# EAGLE design test (EAGLE 9.5.1)

## Sheet 1 of 5: Connectors
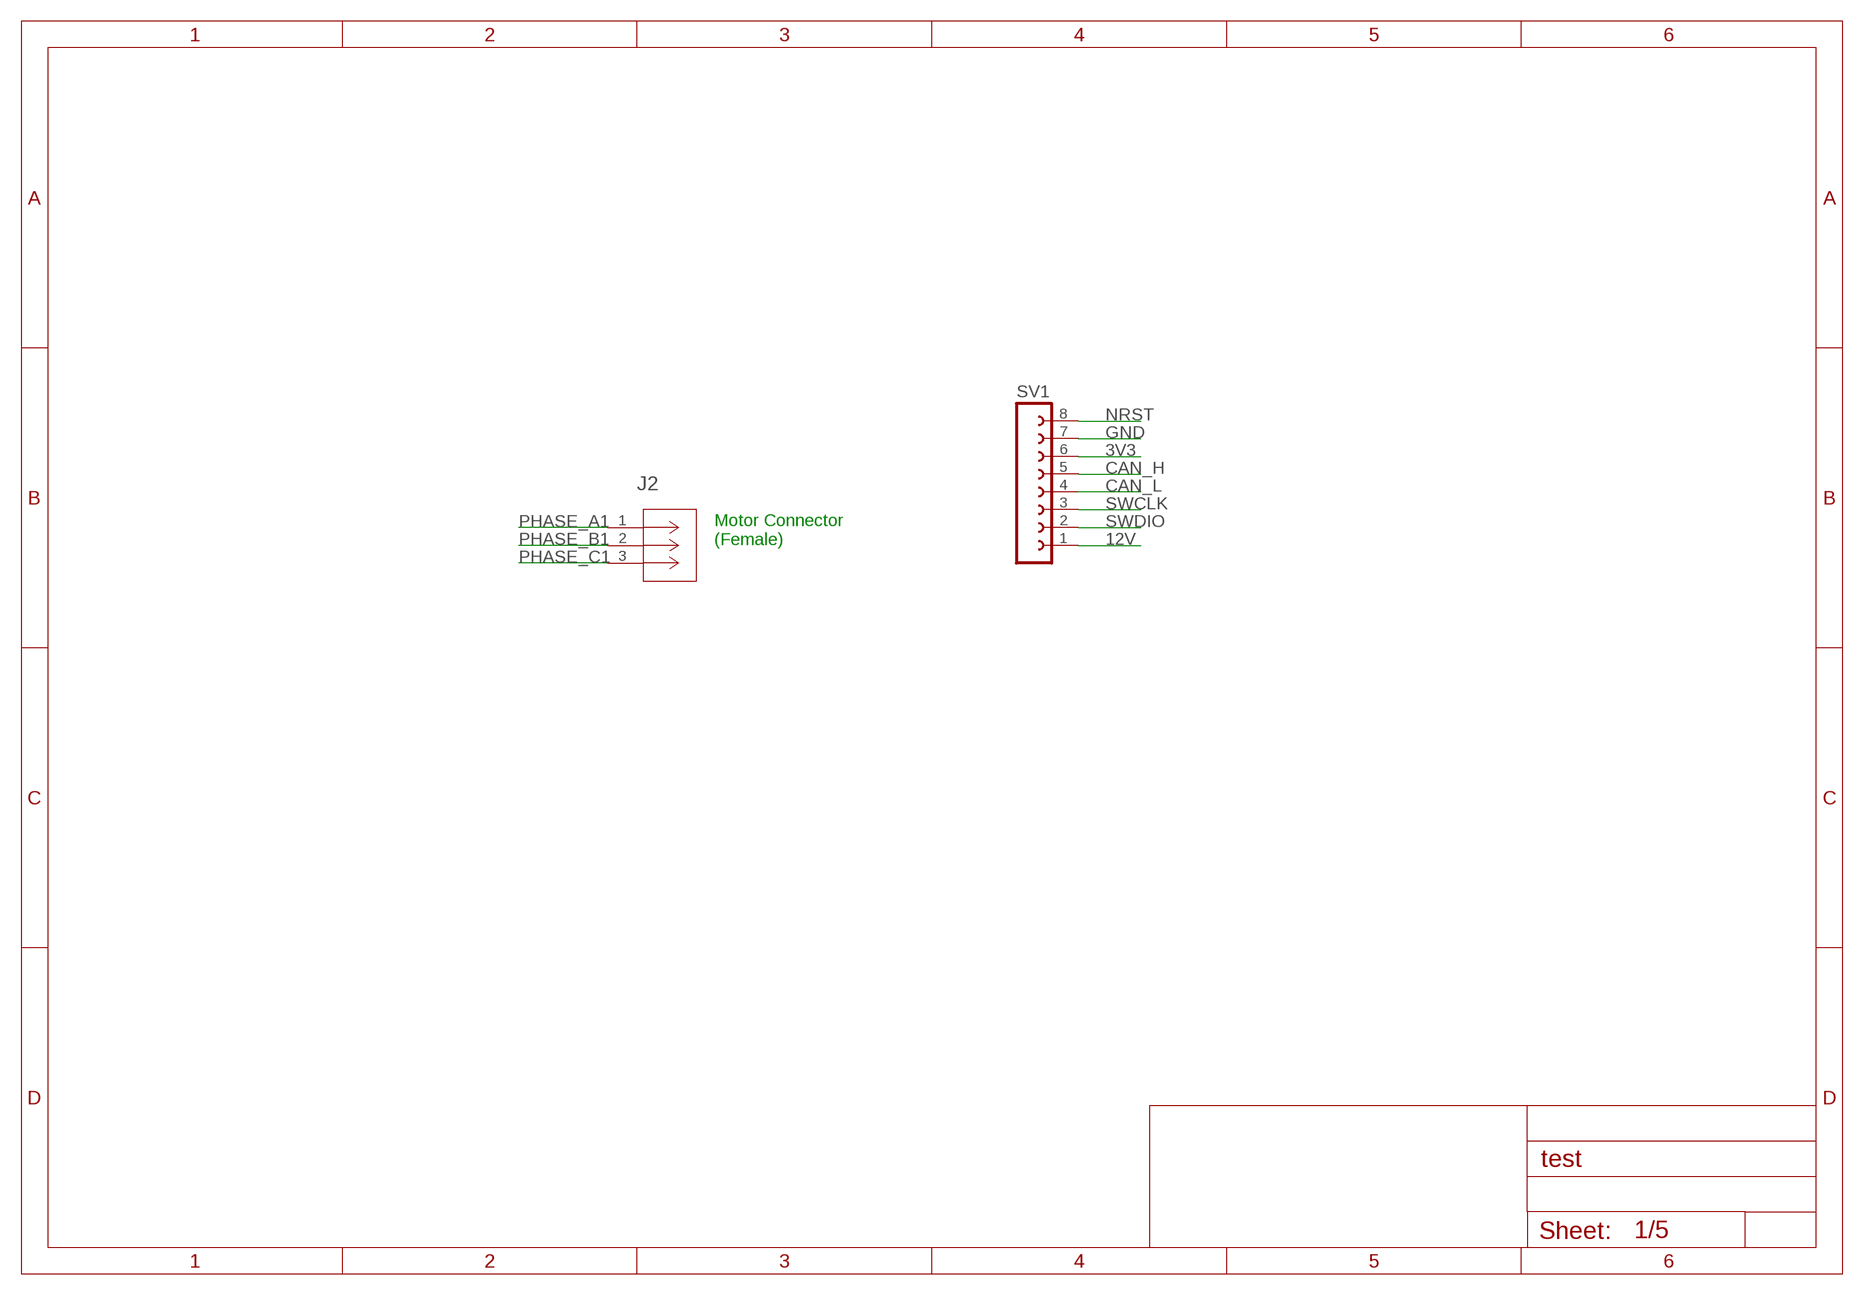
[diagram p0: schematic, sheet 1]

### Parts
J2  1755529  [CONN_1755529]
SV1  FE08-1  [FE08]

### Nets
3V3: SV1.6 ; also sheet 2,3
12V: SV1.1 ; also sheet 4,5
CAN_H: SV1.5 ; also sheet 2
CAN_L: SV1.4 ; also sheet 2
GND: SV1.7 ; also sheet 2,3,4,5
NRST: SV1.8 ; also sheet 3
PHASE_A1: J2.1 ; also sheet 5
PHASE_B1: J2.2 ; also sheet 5
PHASE_C1: J2.3 ; also sheet 5
SWCLK: SV1.3 ; also sheet 3
SWDIO: SV1.2 ; also sheet 3

### Notes on the sheet
- Motor Connector
  (Female)

## Sheet 2 of 5: CAN
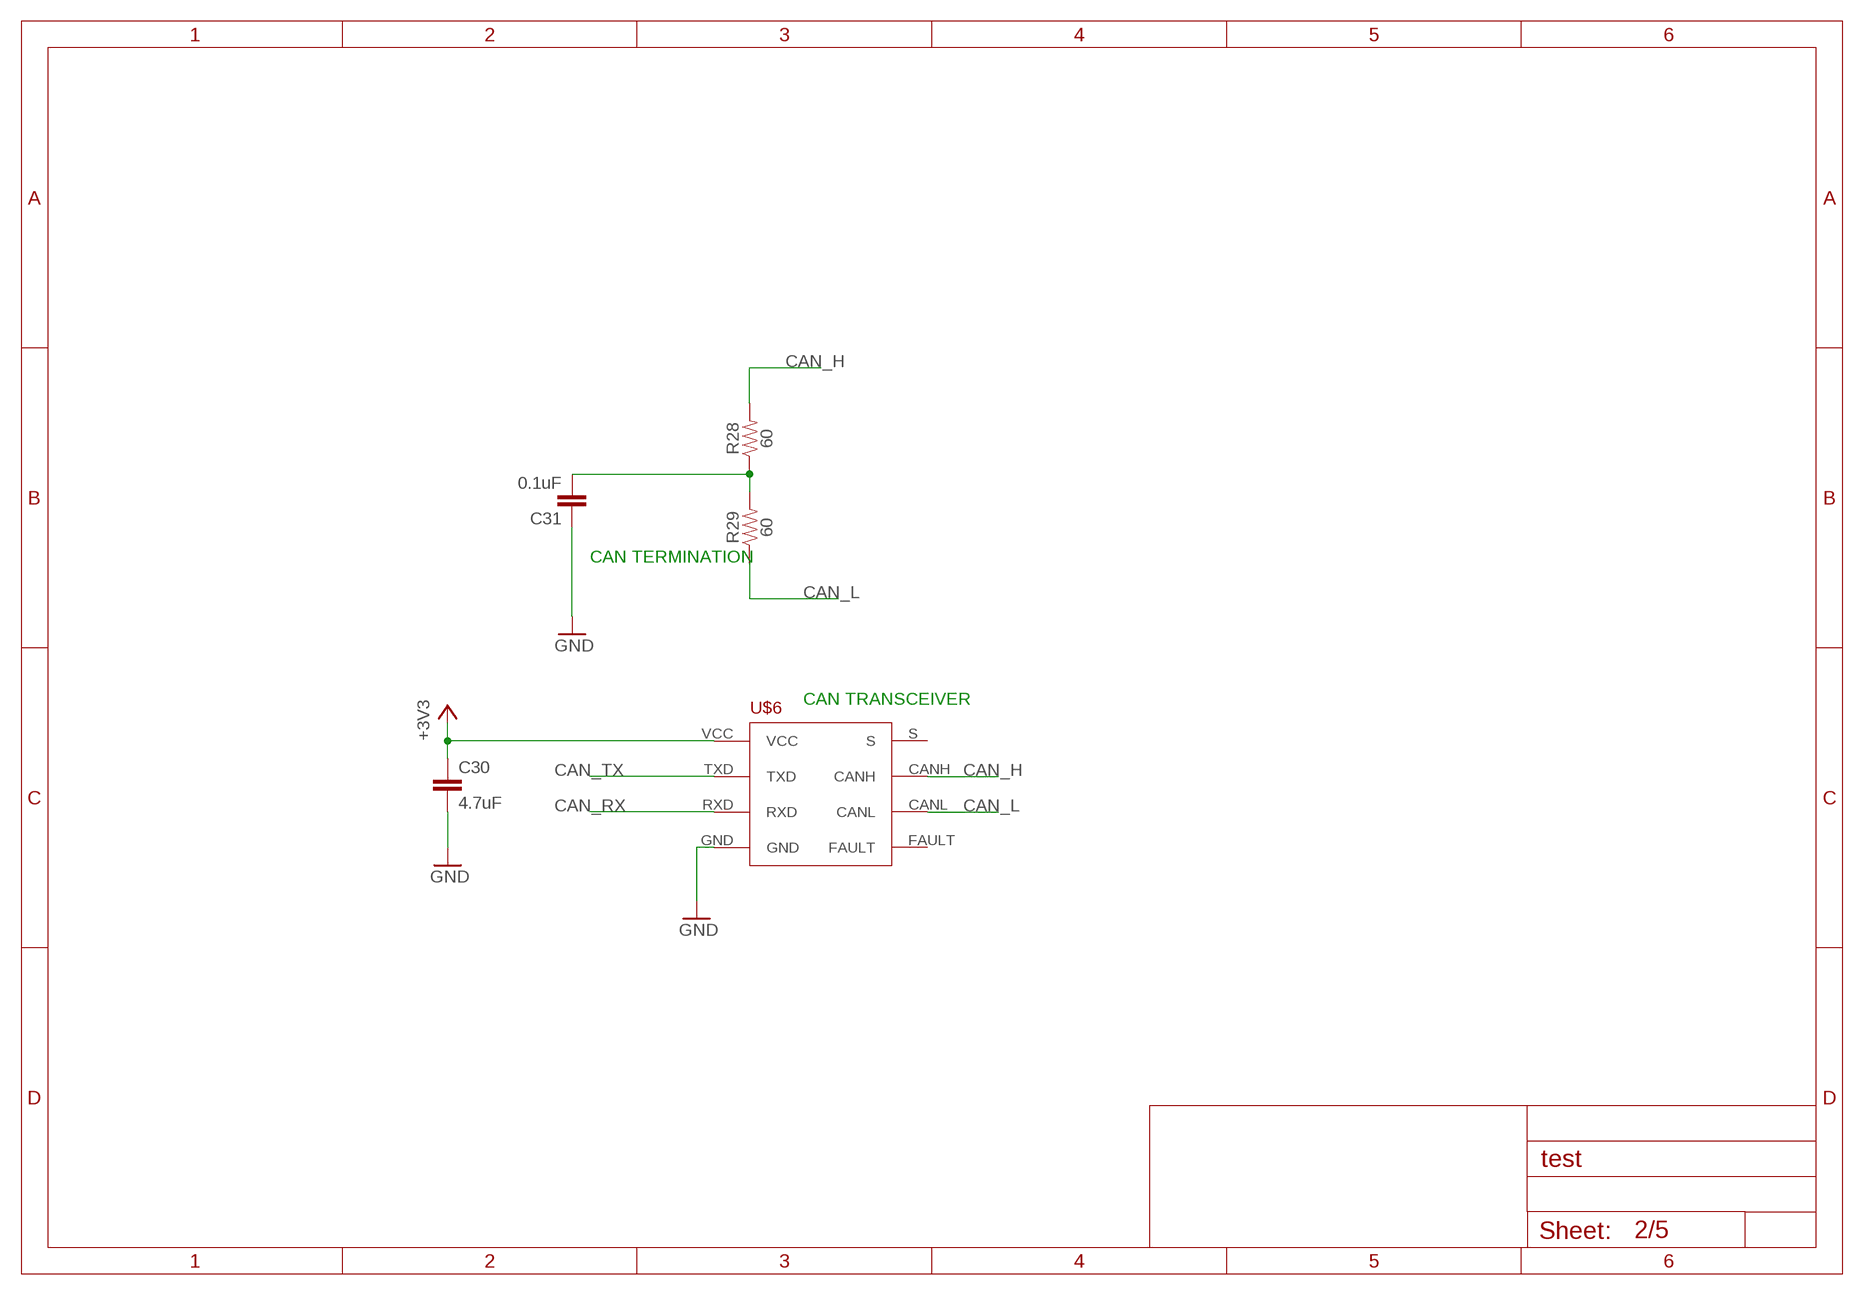
[diagram p1: schematic, sheet 2]

### Parts
C30  4.7uF  4.7UF0603  [0603]
C31  0.1uF  0.1UF-0603-25V-(+80/-20%)  [0603]
R28  60  1KOHM-0603-1/10W-1%  [0603]
R29  60  1KOHM-0603-1/10W-1%  [0603]
U$6  TCAN337D  [TCAN337D]

### Nets
3V3: C30.1 U$6.VCC ; supply symbol labelled +3V3 ; also sheet 1,3
CAN_H: R28.2 U$6.CANH ; also sheet 1
CAN_L: R29.1 U$6.CANL ; also sheet 1
CAN_RX: U$6.RXD ; also sheet 3
CAN_TX: U$6.TXD ; also sheet 3
GND: C30.2 C31.1 U$6.GND ; also sheet 1,3,4,5
N$46: C31.2 R28.1 R29.2
Unconnected: U$6.FAULT U$6.S

### Notes on the sheet
- CAN TERMINATION
- CAN TRANSCEIVER

## Sheet 3 of 5: MCU
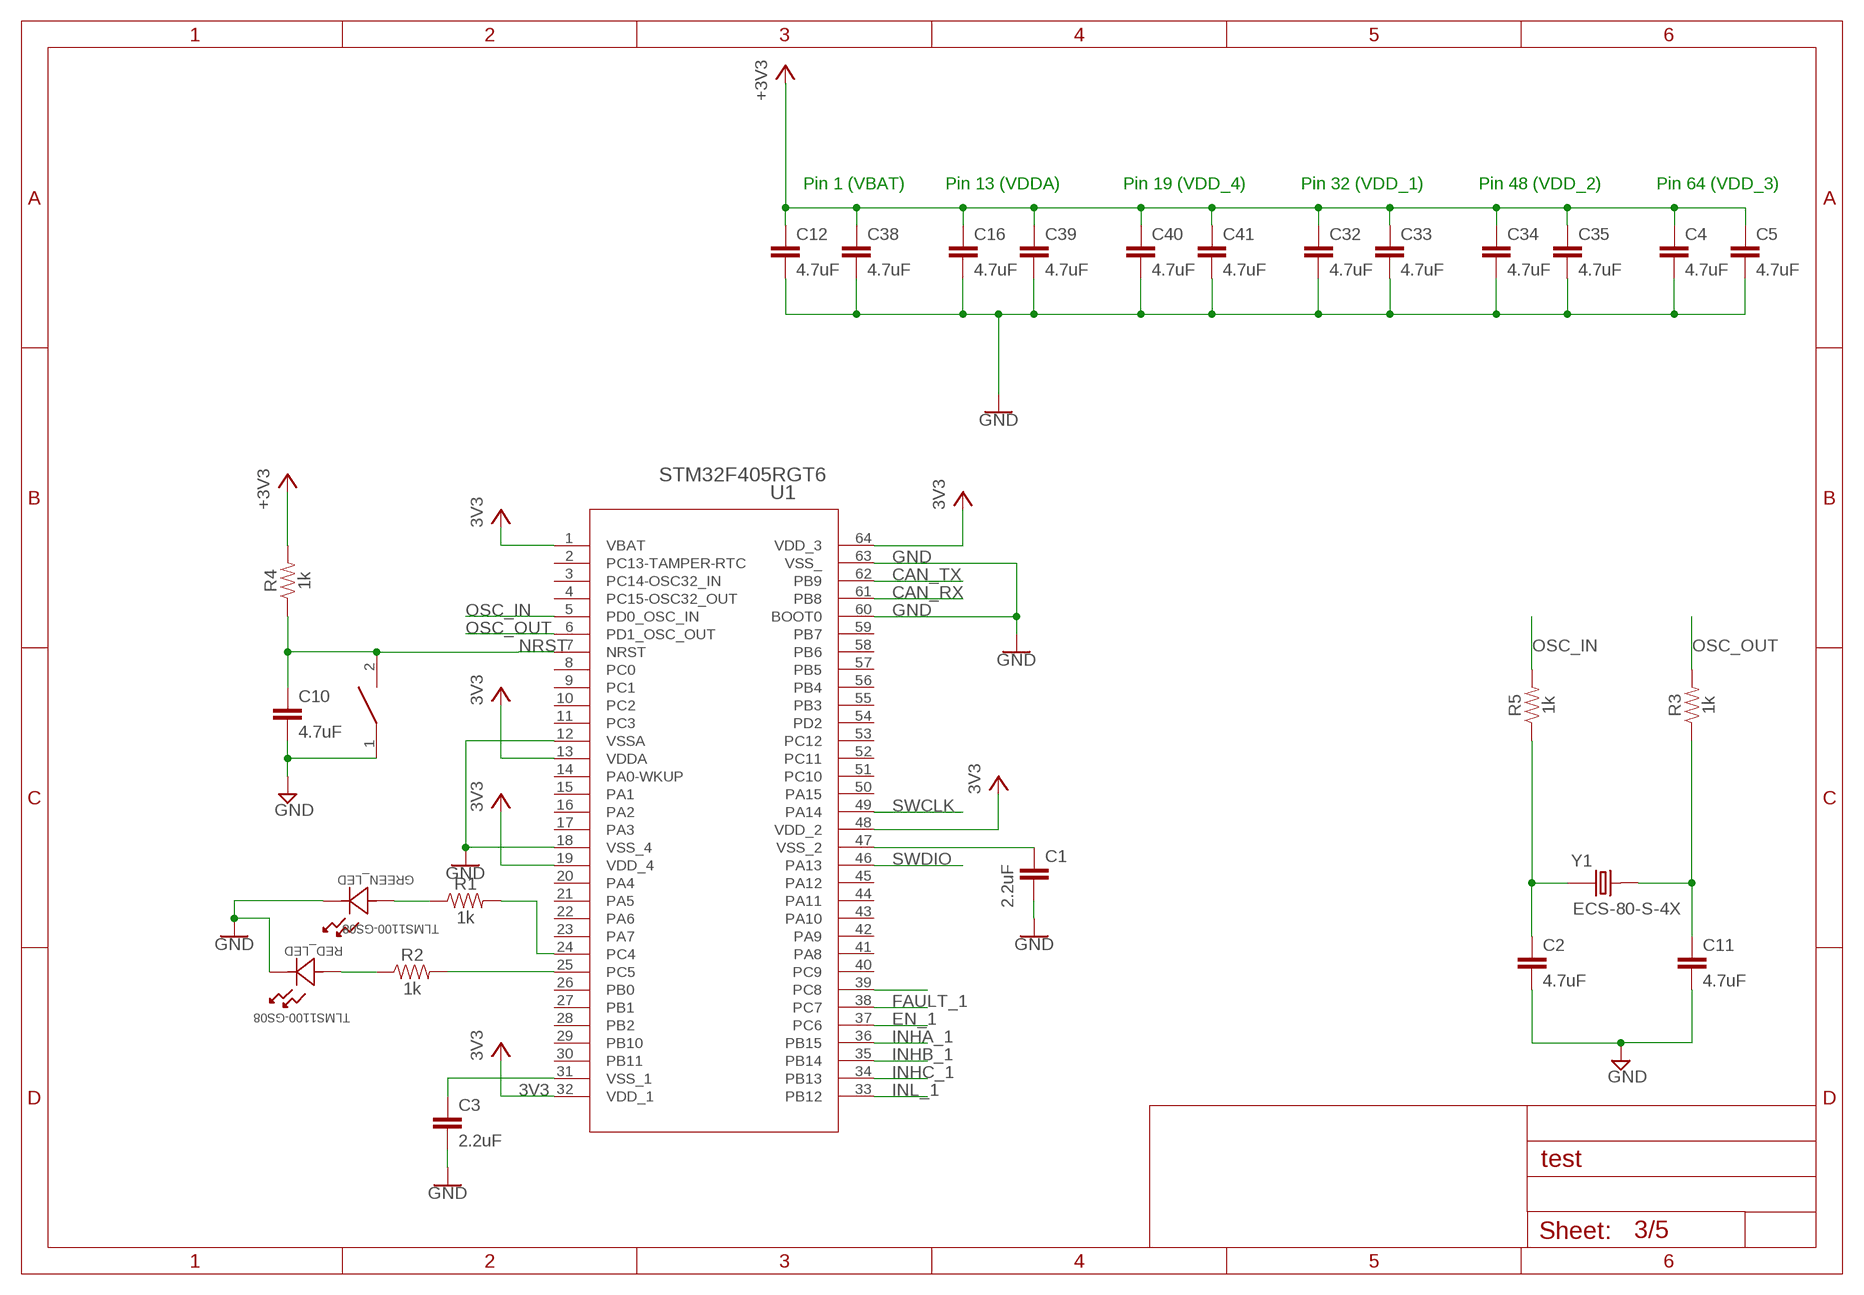
[diagram p2: schematic, sheet 3]

### Parts
C1  2.2uF  2.2UF-0603-10V-20%  [0603]
C2  4.7uF  4.7UF0603  [0603]
C3  2.2uF  2.2UF-0603-10V-20%  [0603]
C4  4.7uF  4.7UF0603  [0603]
C5  4.7uF  4.7UF0603  [0603]
C10  4.7uF  4.7UF0603  [0603]
C11  4.7uF  4.7UF0603  [0603]
C12  4.7uF  4.7UF0603  [0603]
C16  4.7uF  4.7UF0603  [0603]
C32  4.7uF  4.7UF0603  [0603]
C33  4.7uF  4.7UF0603  [0603]
C34  4.7uF  4.7UF0603  [0603]
C35  4.7uF  4.7UF0603  [0603]
C38  4.7uF  4.7UF0603  [0603]
C39  4.7uF  4.7UF0603  [0603]
C40  4.7uF  4.7UF0603  [0603]
C41  4.7uF  4.7UF0603  [0603]
GREEN_LED  TLMS1100-GS08  [LED_VISHAY_TLMX1100]
R1  1k  1KOHM-0603-1/10W-1%  [0603]
R2  1k  1KOHM-0603-1/10W-1%  [0603]
R3  1k  1KOHM-0603-1/10W-1%  [0603]
R4  1k  1KOHM-0603-1/10W-1%  [0603]
R5  1k  1KOHM-0603-1/10W-1%  [0603]
RED_LED  TLMS1100-GS08  [LED_VISHAY_TLMX1100]
RESET1  SWITCH  [SW_2512]
U1  STM32F405RGT6  [LQFP-64]
Y1  ECS-80-S-4X  [XTAL_ECS-80-S-4X]

### Nets
3V3: C4.1 C5.1 C12.1 C16.1 C32.1 C33.1 C34.1 C35.1 C38.1 C39.1 C40.1 C41.1 R4.2 U1.1(VBAT) U1.13(VDDA) U1.19(VDD_4) U1.32(VDD_1) U1.48(VDD_2) U1.64(VDD_3) ; supply symbol labelled +3V3 ; also sheet 1,2
CAN_RX: U1.61(PB8) ; also sheet 2
CAN_TX: U1.62(PB9) ; also sheet 2
EN_1: U1.37(PC6) ; also sheet 4
FAULT_1: U1.38(PC7) ; also sheet 4
GND: C1.2 C2.2 C3.2 C4.2 C5.2 C10.2 C11.2 C12.2 C16.2 C32.2 C33.2 C34.2 C35.2 C38.2 C39.2 C40.2 C41.2 GREEN_LED.1 RED_LED.1 RESET1.1 U1.12(VSSA) U1.18(VSS_4) U1.60(BOOT0) U1.63(VSS_) ; also sheet 1,2,4,5
INHA_1: U1.36(PB15) ; also sheet 4
INHB_1: U1.35(PB14) ; also sheet 4
INHC_1: U1.34(PB13) ; also sheet 4
INL_1: U1.33(PB12) ; also sheet 4
INL_2: U1.39(PC8)
N$1: R1.2 U1.24(PC4)
N$2: GREEN_LED.2 R1.1
N$3: R2.1 RED_LED.2
N$4: R2.2 U1.25(PC5)
N$5: C1.1 U1.47(VSS_2)
N$6: C3.1 U1.31(VSS_1)
N$7: C11.1 R3.1 Y1.2
N$8: C2.1 R5.1 Y1.1
NRST: C10.1 R4.1 RESET1.2 U1.7(NRST) ; also sheet 1
OSC_IN: R5.2 U1.5(PD0_OSC_IN)
OSC_OUT: R3.2 U1.6(PD1_OSC_OUT)
SWCLK: U1.49(PA14) ; also sheet 1
SWDIO: U1.46(PA13) ; also sheet 1
Unconnected: U1.2(PC13-TAMPER-RTC) U1.3(PC14-OSC32_IN) U1.4(PC15-OSC32_OUT) U1.8(PC0) U1.9(PC1) U1.10(PC2) U1.11(PC3) U1.14(PA0-WKUP) U1.15(PA1) U1.16(PA2) U1.17(PA3) U1.20(PA4) U1.21(PA5) U1.22(PA6) U1.23(PA7) U1.26(PB0) U1.27(PB1) U1.28(PB2) U1.29(PB10) U1.30(PB11) U1.40(PC9) U1.41(PA8) U1.42(PA9) U1.43(PA10) U1.44(PA11) U1.45(PA12) U1.50(PA15) U1.51(PC10) U1.52(PC11) U1.53(PC12) U1.54(PD2) U1.55(PB3) U1.56(PB4) U1.57(PB5) U1.58(PB6) U1.59(PB7)

### Notes on the sheet
- Pin 1 (VBAT) | Pin 13 (VDDA) | Pin 19 (VDD_4) | Pin 32 (VDD_1) | Pin 48 (VDD_2) | Pin 64 (VDD_3)

## Sheet 4 of 5: Gate Driver
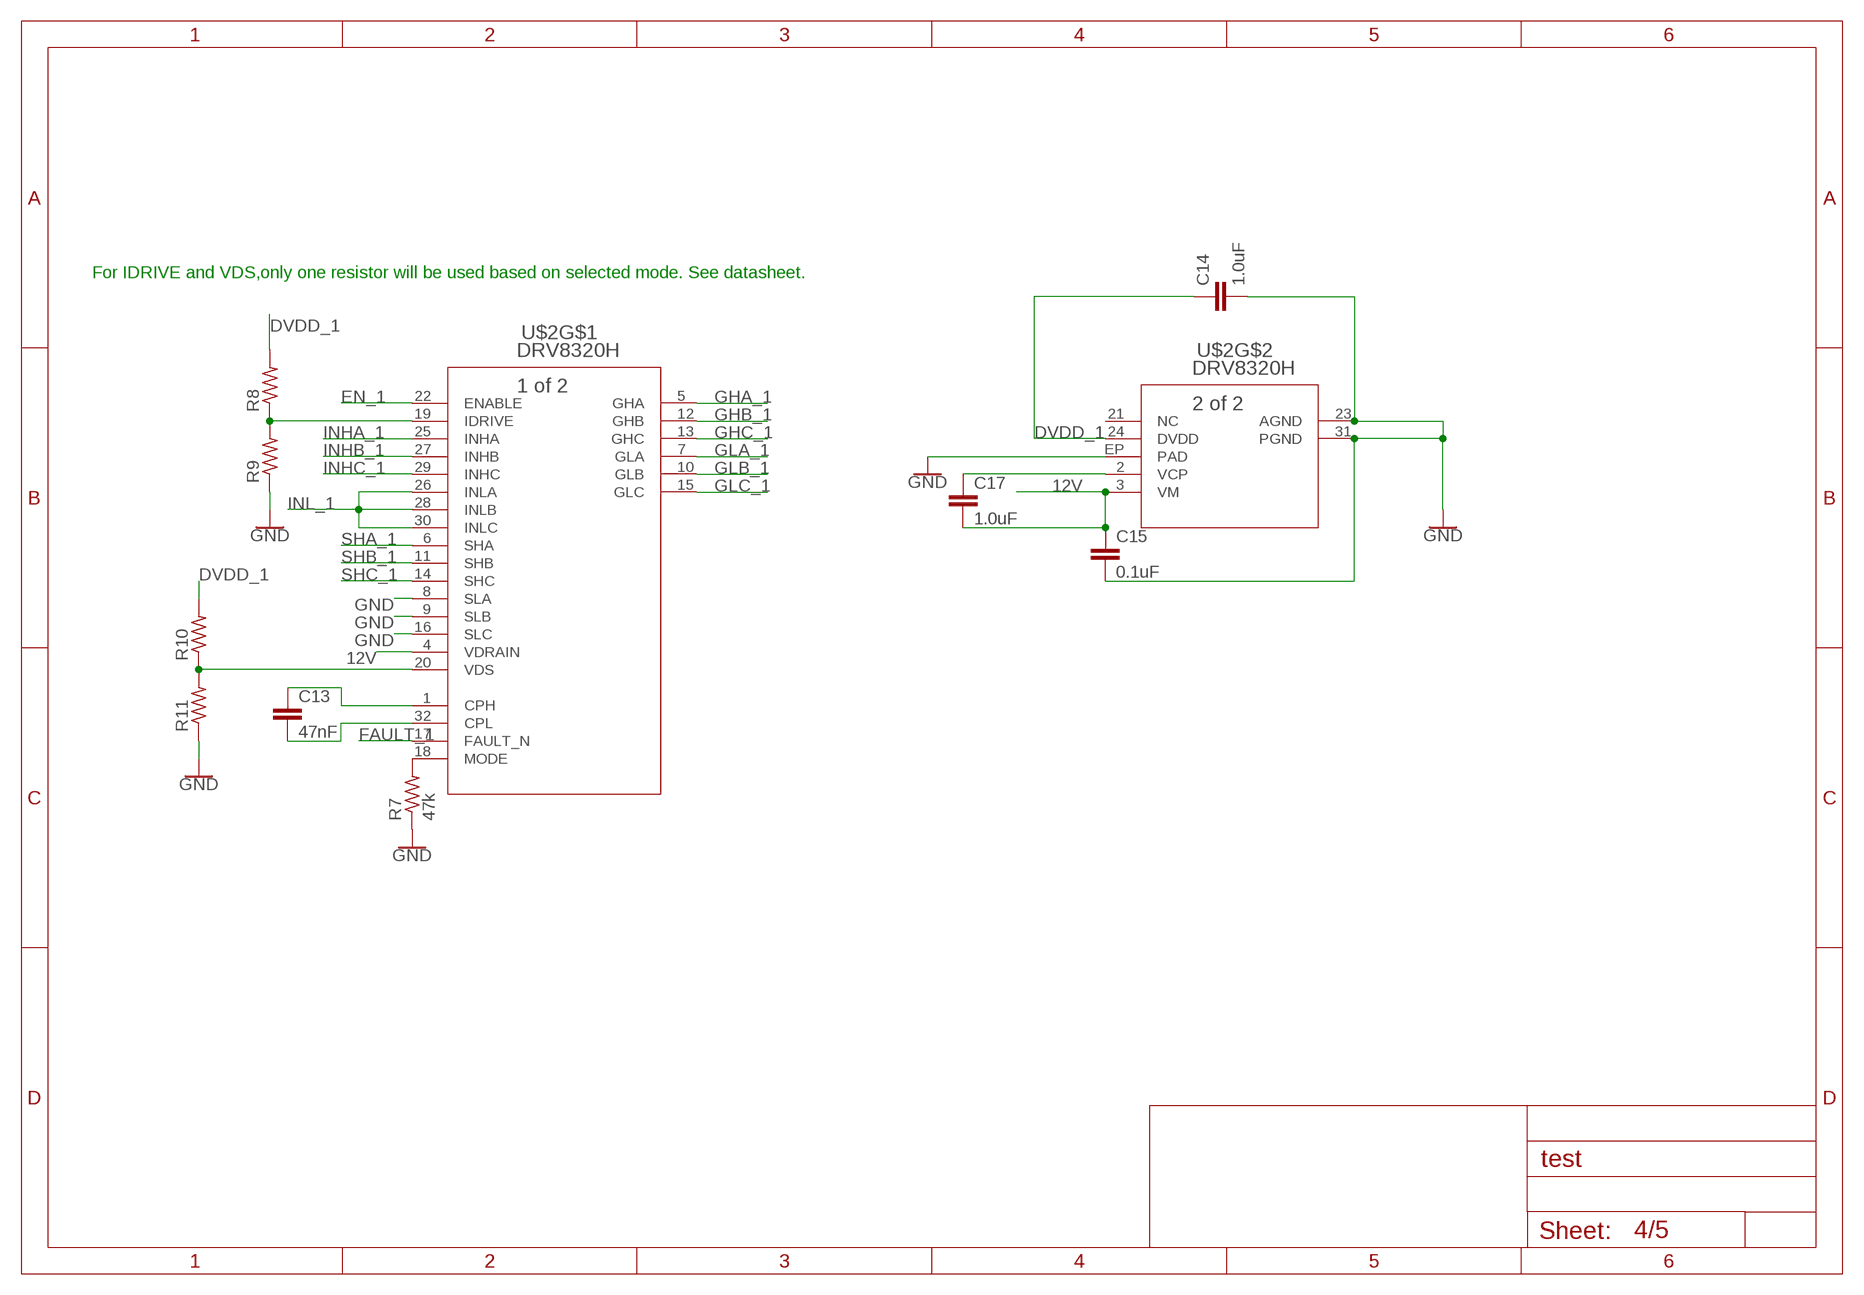
[diagram p3: schematic, sheet 4]

### Parts
C13  47nF  47NF-0603-25V-5%  [0603]
C14  1.0uF  1.0UF-0603-16V-10%  [0603]
C15  0.1uF  0.1UF-0603-25V-(+80/-20%)  [0603]
C17  1.0uF  1.0UF-0603-16V-10%  [0603]
R7  47k  R-US_R0603  [R0603]
R8  R-US_R0603  [R0603]
R9  R-US_R0603  [R0603]
R10  R-US_R0603  [R0603]
R11  R-US_R0603  [R0603]
U$2  DRV8320H  [QFN-32-5X5MM]

### Nets
12V: C15.1 C17.2 U$2.3(VM) U$2.4(VDRAIN) ; also sheet 1,5
DVDD_1: C14.1 R8.2 R10.2 U$2.24(DVDD)
EN_1: U$2.22(ENABLE) ; also sheet 3
FAULT_1: U$2.17(FAULT_N) ; also sheet 3
GHA_1: U$2.5(GHA) ; also sheet 5
GHB_1: U$2.12(GHB) ; also sheet 5
GHC_1: U$2.13(GHC) ; also sheet 5
GLA_1: U$2.7(GLA) ; also sheet 5
GLB_1: U$2.10(GLB) ; also sheet 5
GLC_1: U$2.15(GLC) ; also sheet 5
GND: C14.2 C15.2 R7.1 R9.1 R11.1 U$2.8(SLA) U$2.9(SLB) U$2.16(SLC) U$2.23(AGND) U$2.31(PGND) U$2.EP(PAD) ; also sheet 1,2,3,5
INHA_1: U$2.25(INHA) ; also sheet 3
INHB_1: U$2.27(INHB) ; also sheet 3
INHC_1: U$2.29(INHC) ; also sheet 3
INL_1: U$2.26(INLA) U$2.28(INLB) U$2.30(INLC) ; also sheet 3
N$9: C13.1 U$2.1(CPH)
N$16: C13.2 U$2.32(CPL)
N$17: R8.1 R9.2 U$2.19(IDRIVE)
N$18: R7.2 U$2.18(MODE)
N$19: R10.1 R11.2 U$2.20(VDS)
N$34: C17.1 U$2.2(VCP)
SHA_1: U$2.6(SHA) ; also sheet 5
SHB_1: U$2.11(SHB) ; also sheet 5
SHC_1: U$2.14(SHC) ; also sheet 5
Unconnected: U$2.21(NC)

### Notes on the sheet
- For IDRIVE and VDS,only one resistor will be used based on selected mode. See datasheet.

## Sheet 5 of 5: 6 pack
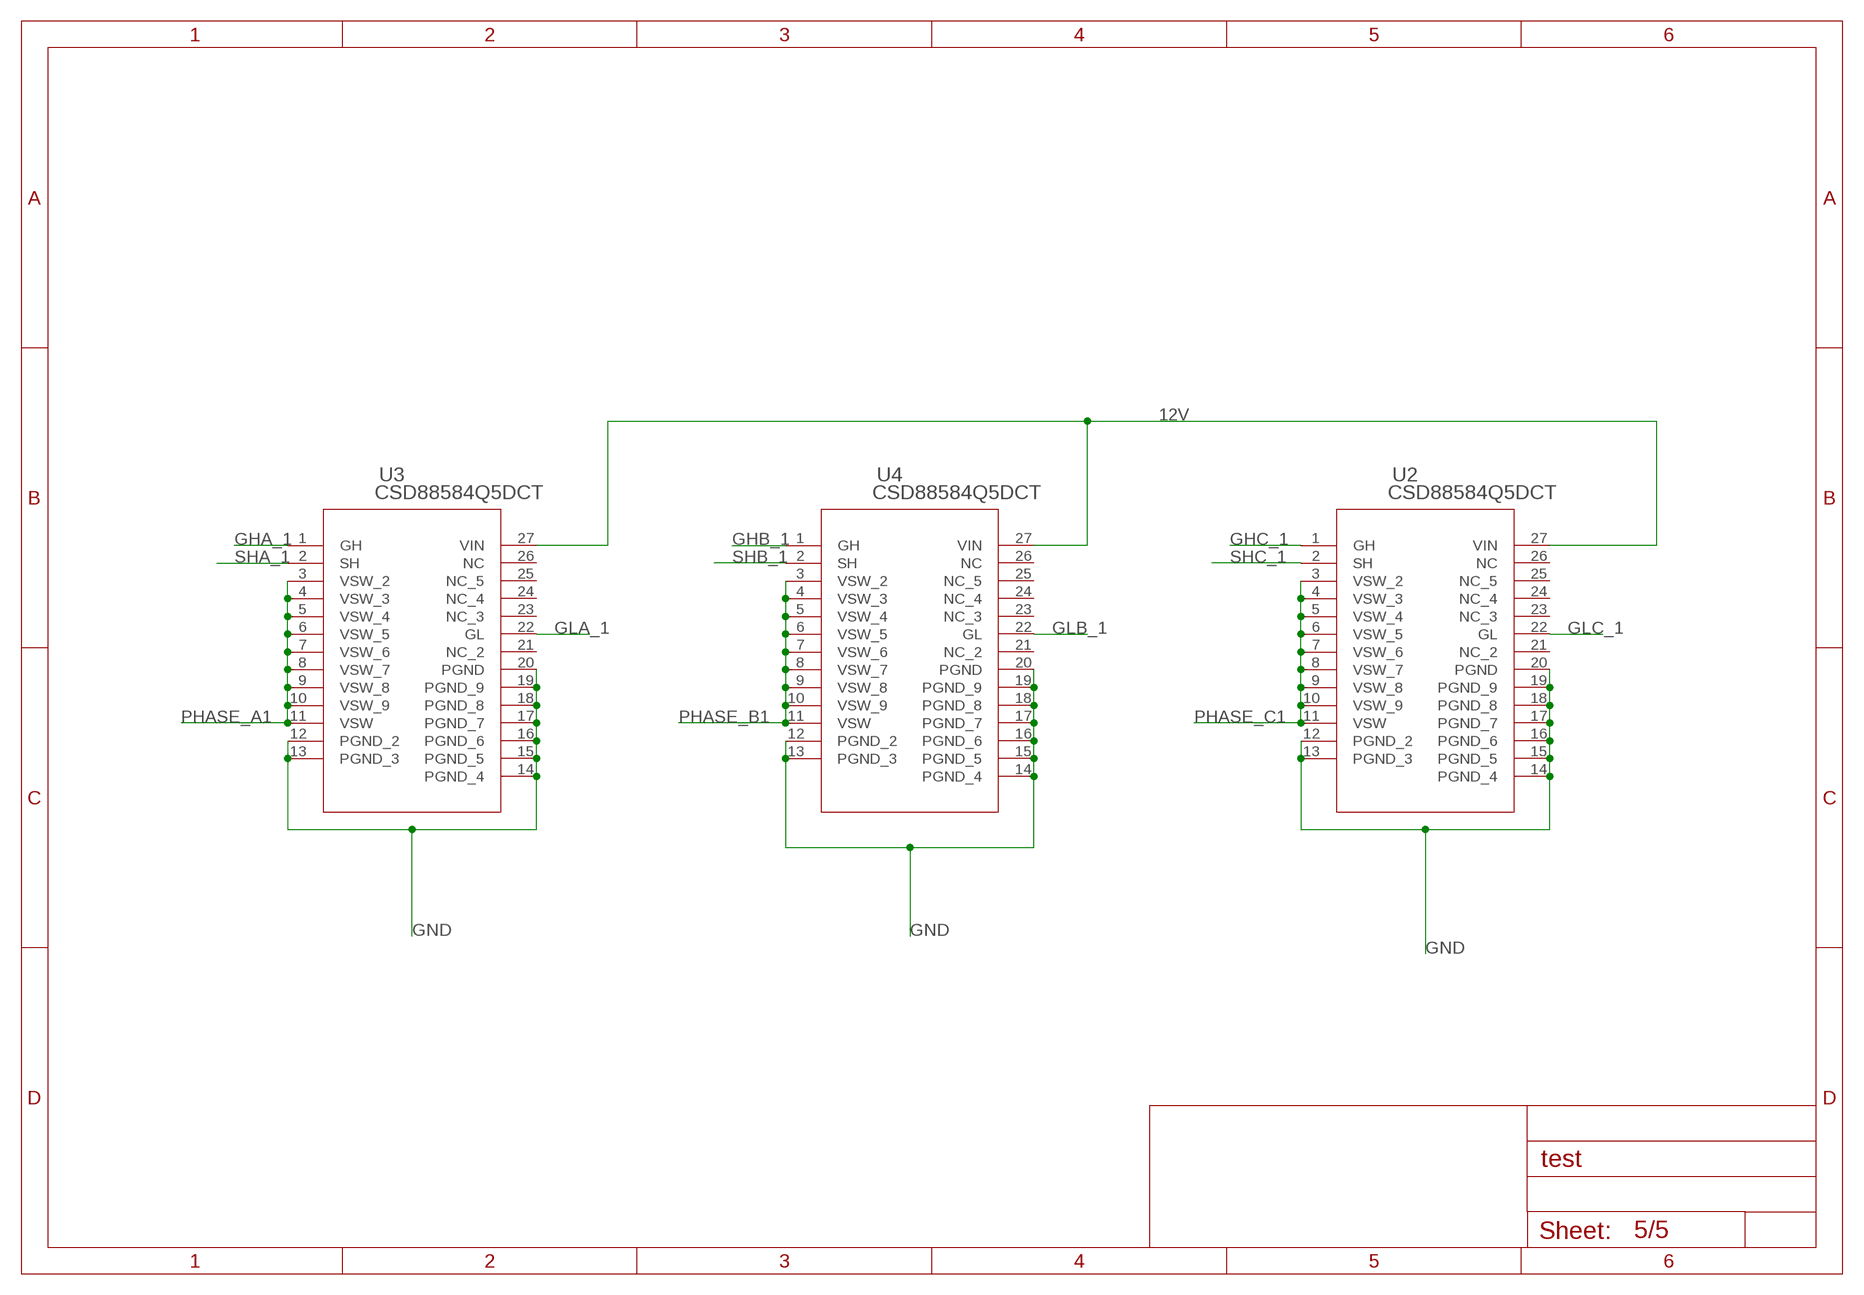
[diagram p4: schematic, sheet 5]

### Parts
U2  CSD88584Q5DCT  [DMM0022A]
U3  CSD88584Q5DCT  [DMM0022A]
U4  CSD88584Q5DCT  [DMM0022A]

### Nets
12V: U2.27(VIN) U3.27(VIN) U4.27(VIN) ; also sheet 1,4
GHA_1: U3.1(GH) ; also sheet 4
GHB_1: U4.1(GH) ; also sheet 4
GHC_1: U2.1(GH) ; also sheet 4
GLA_1: U3.22(GL) ; also sheet 4
GLB_1: U4.22(GL) ; also sheet 4
GLC_1: U2.22(GL) ; also sheet 4
GND: U2.12(PGND_2) U2.13(PGND_3) U2.14(PGND_4) U2.15(PGND_5) U2.16(PGND_6) U2.17(PGND_7) U2.18(PGND_8) U2.19(PGND_9) U2.20(PGND) U3.12(PGND_2) U3.13(PGND_3) U3.14(PGND_4) U3.15(PGND_5) U3.16(PGND_6) U3.17(PGND_7) U3.18(PGND_8) U3.19(PGND_9) U3.20(PGND) U4.12(PGND_2) U4.13(PGND_3) U4.14(PGND_4) U4.15(PGND_5) U4.16(PGND_6) U4.17(PGND_7) U4.18(PGND_8) U4.19(PGND_9) U4.20(PGND) ; also sheet 1,2,3,4
PHASE_A1: U3.3(VSW_2) U3.4(VSW_3) U3.5(VSW_4) U3.6(VSW_5) U3.7(VSW_6) U3.8(VSW_7) U3.9(VSW_8) U3.10(VSW_9) U3.11(VSW) ; also sheet 1
PHASE_B1: U4.3(VSW_2) U4.4(VSW_3) U4.5(VSW_4) U4.6(VSW_5) U4.7(VSW_6) U4.8(VSW_7) U4.9(VSW_8) U4.10(VSW_9) U4.11(VSW) ; also sheet 1
PHASE_C1: U2.3(VSW_2) U2.4(VSW_3) U2.5(VSW_4) U2.6(VSW_5) U2.7(VSW_6) U2.8(VSW_7) U2.9(VSW_8) U2.10(VSW_9) U2.11(VSW) ; also sheet 1
SHA_1: U3.2(SH) ; also sheet 4
SHB_1: U4.2(SH) ; also sheet 4
SHC_1: U2.2(SH) ; also sheet 4
Unconnected: U2.21(NC_2) U2.23(NC_3) U2.24(NC_4) U2.25(NC_5) U2.26(NC) U3.21(NC_2) U3.23(NC_3) U3.24(NC_4) U3.25(NC_5) U3.26(NC) U4.21(NC_2) U4.23(NC_3) U4.24(NC_4) U4.25(NC_5) U4.26(NC)

## Library data of the parts
C1 C3 = SparkFun-Capacitors:2.2UF: 2.2µF ceramic capacitors A capacitor is a passive two-terminal electrical component used to store electrical energy temporarily in an electric field.; PROD_ID: CAP-07888
C2 C4 C5 C10-C12 C16 C30 C32-C35 C38-C41 = SparkFun-Capacitors:4.7UF: 4.7µF ceramic capacitors A capacitor is a passive two-terminal electrical component used to store electrical energy temporarily in an electric field.; PROD_ID: CAP-08280
C13 = SparkFun-Capacitors:47NF: 47nF ceramic capacitors A capacitor is a passive two-terminal electrical component used to store electrical energy temporarily in an electric field.; PROD_ID: CAP-08605
C14 C17 = SparkFun-Capacitors:1.0UF: 1µF ceramic capacitors A capacitor is a passive two-terminal electrical component used to store electrical energy temporarily in an electric field.; PROD_ID: CAP-00868
C15 C31 = SparkFun-Capacitors:0.1UF: 0.1µF ceramic capacitors A capacitor is a passive two-terminal electrical component used to store electrical energy temporarily in an electric field.; PROD_ID: CAP-00810
GREEN_LED RED_LED = VESC_SHIT:TLMS1100-GS08; MANUFACTURER_PART_NUMBER: TLMS1100GS08; VENDOR: Vishay
J2 = VESC_SHIT:1755529: Motor Connector (Female); MANUFACTURER_PART_NUMBER: 1755529; VENDOR: Phoenix Contact
R1-R5 = SparkFun-Resistors:1KOHM: 1kΩ resistor A resistor is a passive two-terminal electrical component that implements electrical resistance as a circuit element. Resistors act to reduce current flow, and, at the same time, act to lower voltage levels within circuits. - Wikipedia; PROD_ID: RES-07856
R7-R11 = rcl:R-US_: RESISTOR, American symbol; SPICEPREFIX: R
R28 R29 = SparkFun-Resistors:1KOHM: 1kΩ resistor A resistor is a passive two-terminal electrical component that implements electrical resistance as a circuit element. Resistors act to reduce current flow, and, at the same time, act to lower voltage levels within circuits. - Wikipedia; PROD_ID: RES-07856; VALUE: 1k
RESET1 = DiscreteComponents:SWITCH
SV1 = con-lsta:FE08-1: FEMALE HEADER; OC_FARNELL: unknown; OC_NEWARK: unknown
U1 = VESC_SHIT:STM32F405RGT6: Microcontroller; MANUFACTURER_PART_NUMBER: STM32F405RGT6; VENDOR: STMicroelectronics
U2-U4 = VESC_SHIT:CSD88584Q5DCT; MANUFACTURER_PART_NUMBER: CSD88584Q5DCT; VENDOR: Texas Instruments
U$2 = VESC_SHIT:DRV8320H
U$6 = PI_Shield_Library:TCAN337D
Y1 = ECS-80-S-4X:ECS-80-S-4X: CRYSTAL T/H; DESCRIPTION: Crystal 8MHz Series 2-Pin HC-49/U; DIGI-KEY_PART_NUMBER: X1057-ND; DIGI-KEY_PURCHASE_URL: https://www.digikey.com/product-detail/en/ecs-inc/ECS-80-S-4X/X1057-ND/827549?utm_source=snapeda&utm_medium=aggregator&utm_campaign=symbol; MF: ECS International; MP: ECS-80-S-4X; PACKAGE: HC-49/US ECS International

## Board
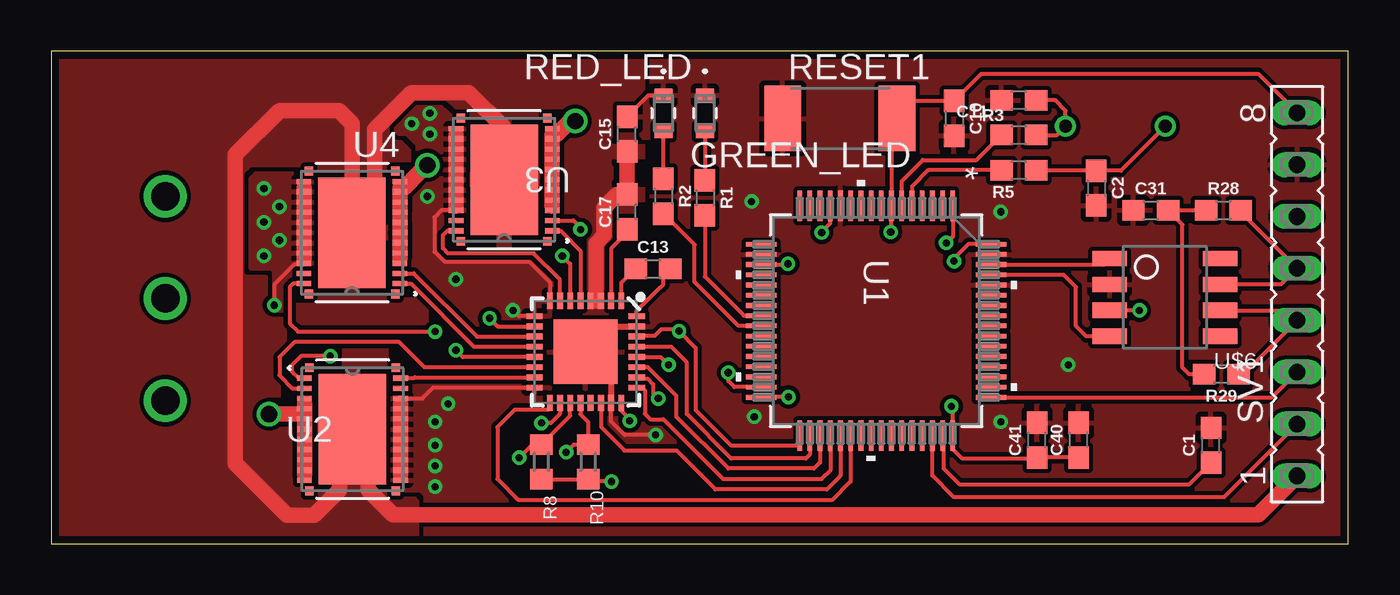
[diagram p5: board, top side]
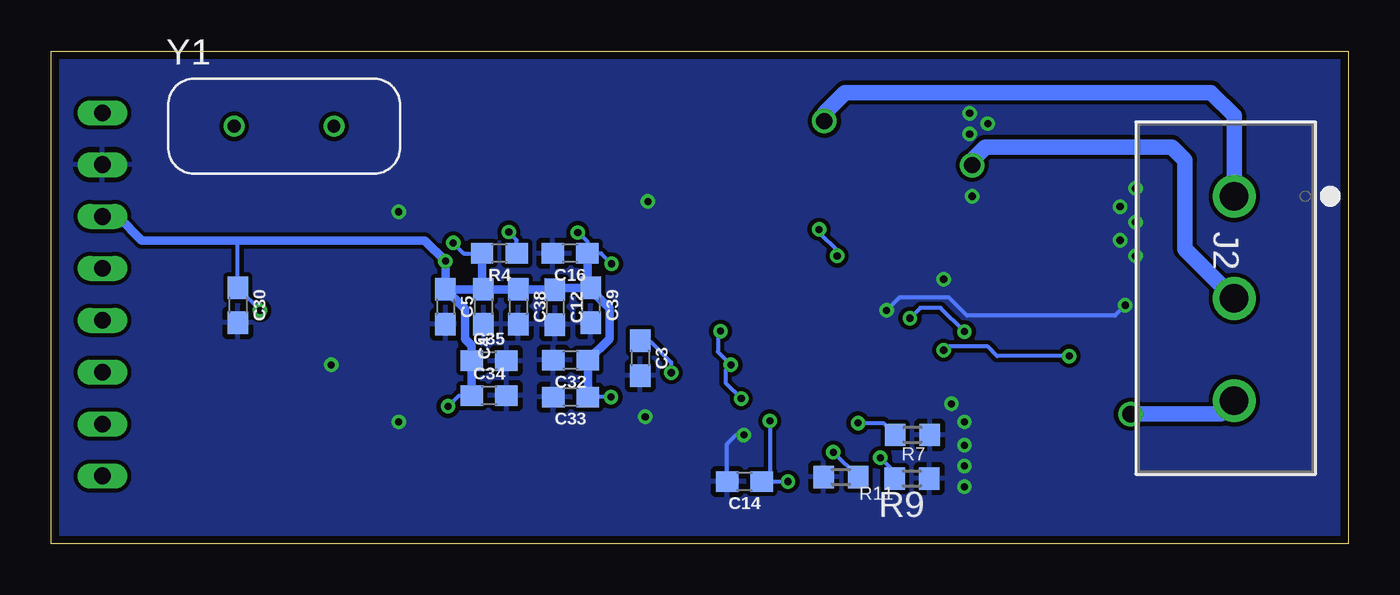
[diagram p6: board, bottom side, seen from below]

Size 63.5 x 24.13 mm. Coordinates in mm from the lower left corner, seen from the top.
Outline: 0,0 63.5,0 63.5,24.13 0,24.13 0,0
Copper layers (1*16): Top 0.0356mm / dielectric 1.5011mm / Bottom 0.0356mm
Design rules "ECE_Senior_Design": minimum track width 8mil, minimum drill 13mil, track to track 8mil, track to pad 8mil, pad to pad 6mil, via to via 8mil, smd to smd 6mil, copper to edge 15mil, drill to drill 8mil, minimum pad ring 7mil, minimum via ring 7mil, stop-mask expansion 3mil, vias tented up to drill 0mil, thermal gap 10mil

### Footprints (pad centres in the part's own frame; a part is rotated, then mirrored left to right if it is on the bottom)
0603 = smd 1.1 x 1: 1 -0.85,0; 2 0.85,0
LED_VISHAY_TLMX1100 = smd 0.66 x 0.889: 1 -0.876,0; 2 0.876,0
CONN_1755529 = drill 1.397 pad 1.905: 1 0,0; 2 5.004,0; 3 10.008,0
R0603 = smd 1 x 1.1: 1 -0.85,0; 2 0.85,0
SW_2512 = smd 1.8 x 3.2: 1 -2.8,0; 2 2.8,0
FE08 = drill 0.813 long: 1 -8.89,0; 2 -6.35,0; 3 -3.81,0; 4 -1.27,0; 5 1.27,0; 6 3.81,0; 7 6.35,0; 8 8.89,0
LQFP-64 = smd 1.473 x 0.229: 1 -5.626,3.75; 2 -5.626,3.25; 3 -5.626,2.75; 4 -5.626,2.25; 5 -5.626,1.75; 6 -5.626,1.25; 7 -5.626,0.75; 8 -5.626,0.25; 9 -5.626,-0.25; 10 -5.626,-0.75; 11 -5.626,-1.25; 12 -5.626,-1.75; 13 -5.626,-2.25; 14 -5.626,-2.75; 15 -5.626,-3.25; 16 -5.626,-3.75; 33 5.626,-3.75; 34 5.626,-3.25; 35 5.626,-2.75; 36 5.626,-2.25; 37 5.626,-1.75; 38 5.626,-1.25; 39 5.626,-0.75; 40 5.626,-0.25; 41 5.626,0.25; 42 5.626,0.75; 43 5.626,1.25; 44 5.626,1.75; 45 5.626,2.25; 46 5.626,2.75; 47 5.626,3.25; 48 5.626,3.75 | smd 0.229 x 1.473: 17 -3.75,-5.626; 18 -3.25,-5.626; 19 -2.75,-5.626; 20 -2.25,-5.626; 21 -1.75,-5.626; 22 -1.25,-5.626; 23 -0.75,-5.626; 24 -0.25,-5.626; 25 0.25,-5.626; 26 0.75,-5.626; 27 1.25,-5.626; 28 1.75,-5.626; 29 2.25,-5.626; 30 2.75,-5.626; 31 3.25,-5.626; 32 3.75,-5.626; 49 3.75,5.626; 50 3.25,5.626; 51 2.75,5.626; 52 2.25,5.626; 53 1.75,5.626; 54 1.25,5.626; 55 0.75,5.626; 56 0.25,5.626; 57 -0.25,5.626; 58 -0.75,5.626; 59 -1.25,5.626; 60 -1.75,5.626; 61 -2.25,5.626; 62 -2.75,5.626; 63 -3.25,5.626; 64 -3.75,5.626
DMM0022A = smd 0.711 x 0.254: 1 -2.35,2.5; 2 -2.35,2; 3 -2.35,1.5; 4 -2.35,1; 5 -2.35,0.5; 6 -2.35,0; 7 -2.35,-0.5; 8 -2.35,-1; 9 -2.35,-1.5; 10 -2.35,-2; 11 -2.35,-2.5; 12 2.35,-2.5; 13 2.35,-2; 14 2.35,-1.5; 15 2.35,-1; 16 2.35,-0.5; 17 2.35,0; 18 2.35,0.5; 19 2.35,1; 20 2.35,1.5; 21 2.35,2; 22 2.35,2.5 | smd 0.432 x 0.432: 23 -2.115,3.013; 24 -2.115,-3.013; 25 2.115,-3.013; 26 2.115,3.013 | smd 3.302 x 5.41: 27 0,0
QFN-32-5X5MM = smd 0.285 x 0.8: 1 -1.75,-2.5; 2 -1.25,-2.5; 3 -0.75,-2.5; 4 -0.25,-2.5; 5 0.25,-2.5; 6 0.75,-2.5; 7 1.25,-2.5; 8 1.75,-2.5; 17 1.75,2.5; 18 1.25,2.5; 19 0.75,2.5; 20 0.25,2.5; 21 -0.25,2.5; 22 -0.75,2.5; 23 -1.25,2.5; 24 -1.75,2.5 | smd 0.8 x 0.285: 9 2.5,-1.75; 10 2.5,-1.25; 11 2.5,-0.75; 12 2.5,-0.25; 13 2.5,0.25; 14 2.5,0.75; 15 2.5,1.25; 16 2.5,1.75; 25 -2.5,1.75; 26 -2.5,1.25; 27 -2.5,0.75; 28 -2.5,0.25; 29 -2.5,-0.25; 30 -2.5,-0.75; 31 -2.5,-1.25; 32 -2.5,-1.75 | smd 3.15 x 3.15: EP 0,0
TCAN337D = smd 1.7 x 0.75: CANH 5.4,2.54; CANL 5.4,1.27; FAULT 5.4,0; GND 0,2.54; RXD 0,0; S 5.4,3.81; TXD 0,3.81; VCC 0,1.27
XTAL_ECS-80-S-4X = drill 0.63 pad 1.03: 1 -2.44,0; 2 2.44,0

### Placement (x,y rotation side)
C1  56.77,4.83 90 top
C2  51.16,17.42 270 top
C3  34.67,9.09 270 bottom
C4  42.34,11.61 270 bottom
C5  44.2,11.61 270 bottom
C10  44.2,20.83 270 top
C11  47.37,21.72 180 top
C12  38.84,11.58 270 bottom
C13  29.46,13.46 0 top
C14  29.57,3.05 180 bottom
C15  28.19,20.07 90 top
C16  38.1,14.22 180 bottom
C17  28.19,16.26 90 top
C30  54.36,11.68 270 bottom
C31  53.82,16.33 0 top
C32  38.07,8.99 180 bottom
C33  38.07,7.19 180 bottom
C34  42.06,7.26 0 bottom
C35  42.06,8.97 0 bottom
C38  40.64,11.61 270 bottom
C39  37.08,11.68 270 bottom
C40  50.29,5.08 90 top
C41  48.26,5.08 90 top
GREEN_LED  32,21.08 270 top
J2  5.59,17.02 270 bottom
R1  32,16.94 270 top
R2  29.97,17.02 270 top
R3  47.37,20.02 180 top
R4  41.55,14.22 180 bottom
R5  47.37,18.29 180 top
R7  21.34,5.33 180 bottom
R8  24,4.01 270 top
R9  21.36,3.2 180 bottom
R10  26.29,4.01 270 top
R11  24.84,3.28 0 bottom
R28  57.38,16.33 0 top
R29  57.28,8.31 180 top
RED_LED  29.97,21.08 270 top
RESET1  38.61,20.83 0 top
SV1  60.99,12.22 90 top
U1  40.39,10.92 270 top
U2  14.76,5.61 0 top
U3  22.17,17.83 180 top
U4  14.73,15.24 180 top
U$2  26.16,9.4 180 top
U$6  51.82,10.16 0 top
Y1  52.1,20.45 0 bottom

### Tracks (layer width: path | path; a pad name or v marks a point on that pad's centre or on a via)
3V3  (via drill 0.35)
  Top 0.203: U1.1 44.14,15.05 v43.81,14.73 | U1.13 38.14,15.7 37.72,15.28 v37.72,15.24 | U1.19 36.02,13.67 v36.07,13.72 | v44.07,6.73 44.14,6.66 U1.48 44.14,4.63 44.58,4.19 48.22,4.19 C41.1 C40.1 | v36.09,7.19 34.78,7.19 U1.32 | U1.64 44.9,14.67 44.2,13.97 v44.2,13.84 | v53.27,11.43 U$6.VCC
  Bottom 0.203: 37.19,12.43 37.13,12.49 C39.1 | v53.27,11.43 53.27,11.45 C30.1 54.36,14.86 | v36.07,13.72 36.58,14.22 C16.1 37.25,14.81 37.68,15.24 v37.72,15.24 | v44.07,6.73 43.54,7.26 C34.1 | v36.09,7.19 C33.1 | v43.81,14.73 43.31,14.22 R4.2
  Bottom 0.406: SV1.6 60.22,16.03 59.05,14.86 54.36,14.86 45.21,14.86 v44.2,13.84 C5.1 | C5.1 C4.1 | R4.2 42.4,12.43 42.39,12.41 C4.1 | C16.1 37.25,12.5 37.19,12.43 | C33.1 C32.1 36.18,10.04 36.18,11.55 36.42,11.79 36.43,11.79 37.13,12.49 | C34.1 C35.1 42.91,9.7 43.25,10.04 43.25,11.51 C5.1 | C39.1 38.73,12.53 C12.1 38.86,12.46 C38.1 C4.1
12V
  Top 0.203: U$2.3 26.66,11.9 U$2.4
  Top 0.762: SV1.1 59.08,1.42 16.74,1.42 15.52,2.64 15.52,4.85 U2.27 14.12,4.98 14.12,2.64 12.88,1.4 11.56,1.4 9.02,3.94 9.02,19.05 11.18,21.21 14.1,21.21 14.73,20.57 U4.27 15.84,16.35 15.84,20.29 17.65,22.1 20.45,22.1 22.17,20.37 U3.27 | 26.66,11.9 26.66,14.71 27.07,15.12 27.07,16.47 27.71,17.11 C17.2 C15.1
  pour Top (rank 3): 0.13,24.13 0.13,0 17.65,0 17.65,5.08 21.84,5.08 28.7,11.94 28.7,24.13
CAN_H
  Top 0.203: U$6.CANH 60.2,12.7 SV1.5 58.23,16.24 R28.2
CAN_L
  Top 0.203: R29.1 58.34,8.31 SV1.4 60.5,11.43 U$6.CANL
CAN_RX
  Top 0.203: U$6.RXD 50.67,10.16 50.16,10.67 50.16,12.57 49.57,13.17 U1.61
CAN_TX
  Top 0.203: U1.62 51.52,13.67 U$6.TXD
DVDD_1  (via drill 0.35)
  Top 0.203: R8.2 R10.2 26.4,3.05 v27.43,3.05 | U$2.24 27.91,6.52 28.28,6.15 28.28,6.06 v28.32,6.02
  Bottom 0.203: v27.43,3.05 C14.1 28.32,3.44 v28.32,6.02
EN_1
  Top 0.203: U1.37 38.64,3.33 37.97,2.67 32.51,2.67 30.61,4.57 28.07,4.57 26.92,5.71 26.92,6.89 U$2.22
FAULT_1
  Top 0.203: U1.38 39.14,3.05 38.25,2.16 22.86,2.16 21.84,3.17 21.84,5.71 22.71,6.58 24.35,6.58 24.41,6.64 U$2.17
GHA_1
  Top 0.203: U$2.5 25.91,14.35 24.93,15.33 U3.1
GHB_1
  Top 0.203: U$2.12 20.7,9.65 17.61,12.74 U4.1
GHC_1  (via drill 0.35)
  Top 0.203: U$2.13 20.14,9.15 v19.82,9.48 | v13.66,9.2 12.24,9.2 11.81,8.76 11.81,8.41 12.11,8.11 U2.1
  Bottom 0.203: v13.66,9.2 17.2,9.2 17.65,9.65 19.64,9.65 v19.82,9.48
GLA_1
  Top 0.203: U$2.7 24.91,12.93 23.62,14.22 19.43,14.22 19.18,14.48 19.18,15.11 19.4,15.34 19.43,15.34 19.43,15.33 U3.22
GLB_1  (via drill 0.35)
  Top 0.203: U$2.10 21.86,10.65 v21.46,11.05 | v18.8,10.39 12.09,10.39 11.68,10.79 11.68,12.57 11.85,12.74 U4.22
  Bottom 0.203: v18.8,10.39 19.96,11.56 20.95,11.56 v21.46,11.05
GLC_1
  Top 0.203: U2.22 17.77,8.11 17.8,8.15 U$2.15
GND  (via drill 0.35)
  Top 0.203: RED_LED.1 29.24,21.96 C15.2 | U$2.EP 27.41,10.65 | 27.56,10.65 27.41,10.5 U$2.23 27.41,5.99 28.07,5.33 v29.59,5.33 | U3.12 19.82,20.04 U3.13 | U3.20 19.82,16.54 | U3.19 U3.20 | U3.20 19.12,16.33 18.77,15.98 18.77,14.31 19.26,13.82 23.39,13.82 24.41,12.8 U$2.8 | U4.19 12.38,13.97 U4.20 12.31,13.67 11.9,13.67 10.92,12.69 v10.92,11.68 | U4.12 12.38,17.45 U4.13 | U$2.9 22.89,11.15 v22.61,11.43 | 23.62,7.37 23.66,7.41 U$2.16 18.7,7.65 18.16,7.11 U2.20 | U2.12 17.11,3.4 U2.13
  Top 0.305: U$2.EP 27.41,8.15 U$2.23 | 27.41,10.65 27.56,10.65 U$2.31 | U2.19 17.11,6.86 U2.20
  Top 0.762: 19.82,20.04 U3.14 U3.15 U3.16 U3.17 U3.18 19.82,16.54 | U4.19 U4.18 | U4.18 U4.17 U4.16 U4.15 U4.14 | U4.14 U4.13 | U4.14 12.38,17.45 | U4.18 12.38,13.97 | U2.19 U2.18 | U2.18 U2.17 U2.16 U2.15 U2.14 | U2.14 U2.13 | U2.18 17.11,6.86 | U2.14 17.11,3.4
  Bottom 0.203: C14.2 30.42,4.89 29.98,5.33 v29.59,5.33 | v10.92,11.68 11.43,11.18 18.67,11.18 19.56,12.06 21.97,12.06 v22.61,11.43
  other vias: 34.29,16.76 46.48,16.26 46.48,5.97 34.42,6.22 10.41,17.4 10.41,15.75 10.41,14.1 17.65,20.57 18.54,21.08 18.54,20.07 18.41,17.02 19.81,12.95 18.8,2.79 18.8,3.81 18.8,4.83 18.8,5.97 11.18,16.51 11.18,14.86 19.43,6.86 49.78,8.76
  pour Top (rank 6): 0,24.13 0,0 63.5,0 63.5,24.13
  pour Bottom: 0,24.13 0,0 63.5,0 63.5,24.13
  pour Top: 10.92,13.34 10.79,13.46 9.78,13.46 9.78,17.91 10.03,18.16 10.16,18.16 12.45,18.16 12.83,17.78 12.83,13.84 11.68,13.84 11.18,13.34
  pour Top: 18.16,21.59 18.92,21.59 19.56,20.95 19.56,20.7 19.68,20.57 20.19,20.57 20.19,16.76 20.07,16.64 19.05,16.64 18.8,16.38 18.16,16.38 17.91,16.64 17.91,17.27 18.41,17.78 18.8,17.78 19.18,18.16 19.18,18.92 18.54,19.56 18.41,19.56 17.91,19.56 17.65,19.81 17.4,20.07 17.02,20.07 16.89,20.19 16.89,20.57 17.91,21.59
  pour Top: 19.3,2.29 18.41,2.29 17.91,2.79 17.78,2.92 16.89,2.92 16.64,3.17 16.64,6.35 17.14,6.86 18.16,6.86 18.41,6.86 18.92,7.37 19.81,7.37 20.19,6.99 20.32,6.86 20.32,6.6 20.32,3.3
INHA_1
  Top 0.203: U1.36 38.14,3.59 37.72,3.17 32.89,3.17 29.97,6.1 29.34,6.1 29.06,6.37 29.06,7.52 28.93,7.65 U$2.25
INHB_1
  Top 0.203: U1.35 37.64,3.98 37.34,3.68 33.15,3.68 30.61,6.22 30.61,7.25 29.21,8.65 U$2.27
INHC_1
  Top 0.203: U1.34 37.14,4.37 36.94,4.18 33.29,4.18 31.11,6.35 31.11,8.89 30.36,9.65 U$2.29
INL_1  (via drill 0.35)
  Top 0.203: U1.33 36.64,4.92 36.55,4.83 33.27,4.83 31.55,6.55 31.55,9.6 v30.73,10.41 30.64,10.51 29.88,10.51 29.56,10.19 28.7,10.19 U$2.30 | U$2.26 28.71,8.1 29.19,8.1 29.47,7.82 29.47,7.36 v29.72,7.11 | U$2.28 29.84,9.15 v30.23,8.76
  Bottom 0.203: v30.73,10.41 30.86,10.29 30.86,9.4 v30.23,8.76 30.48,8.51 30.48,7.87 v29.72,7.11
N$1
  Top 0.203: R1.2 32,13.08 33.91,11.17 U1.24
N$2
  Top 0.203: GREEN_LED.2 R1.1
N$3
  Top 0.203: R2.1 RED_LED.2
N$4
  Top 0.203: U1.25 34.04,10.67 33.66,10.67 31.5,12.83 31.5,14.64 R2.2
N$5
  Top 0.203: U1.47 43.69,5.24 43.69,3.68 44.45,2.92 55.71,2.92 C1.1
N$6  (via drill 0.35)
  Top 0.203: U1.31 33.44,7.67 33.15,7.96 v33.15,8.38
  Bottom 0.203: C3.1 34.63,9.91 34.16,9.91 33.15,8.89 v33.15,8.38
N$7
  Top 0.203: R3.1 49.22,20.02 Y1.2 49.66,21.21 49.15,21.72 C11.1
N$8
  Top 0.203: Y1.1 52.36,18.27 C2.1 48.23,18.27 R5.1
N$9
  Top 0.203: U$2.1 27.91,12.79 28.59,13.46 C13.1
N$16
  Top 0.203: U$2.32 28.66,11.4 29.83,12.57 29.84,12.57 29.97,12.7 29.97,13.34 30.31,13.34 C13.2
N$17  (via drill 0.35)
  Top 0.203: U$2.19 25.41,6.27 R8.1 23.56,4.86 v22.91,4.22
  Bottom 0.203: R9.2 22.21,3.52 v22.91,4.22
N$18  (via drill 0.35)
  Top 0.203: U$2.18 24.91,6.37 24.46,5.92 v24,5.92
  Bottom 0.203: v24,5.92 22.77,5.92 R7.2
N$19  (via drill 0.35)
  Top 0.203: U$2.20 25.91,6.35 26.29,5.97 R10.1 25.59,4.86 v25.21,4.48
  Bottom 0.203: v25.21,4.48 v25.2,4.48 R11.2
N$34
  Top 0.203: C17.1 28.19,15.24 27.41,14.46 U$2.2
N$46
  Top 0.203: R29.2 55.7,8.31 55.37,8.64 55.37,15.63 C31.2 R28.1
NRST  (via drill 0.35)
  Top 0.203: SV1.8 59.08,23.01 45.53,23.01 C10.1 42.26,21.68 RESET1.2 41.14,20.56 U1.7 41.14,15.3 v41.1,15.27
  Bottom 0.203: R4.1 40.7,14.87 v41.1,15.27
OSC_IN
  Top 0.203: R5.2 42.93,18.29 42.14,17.5 U1.5
OSC_OUT
  Top 0.203: U1.6 41.64,17.76 42.67,18.8 45.3,18.8 R3.2
PHASE_A1  (via drill 0.8)
  Top 0.203: U3.3 24.52,16.54 U3.4 | U3.11 24.52,20.04 U3.10
  Top 0.762: U3.5 U3.6 U3.7 U3.8 U3.9 24.52,20.04 | U3.5 U3.4 | v25.65,20.7 25.4,20.7 24.75,20.04 24.74,20.04 U3.10 | U3.5 24.52,16.54
  Bottom 0.762: J2.1 5.59,20.95 6.73,22.1 24.64,22.1 25.65,21.08 v25.65,20.7
PHASE_B1  (via drill 0.8)
  Top 0.203: U4.3 17.08,13.97 U4.4 | U4.11 17.08,17.45 U4.10
  Top 0.762: U4.9 U4.10 17.3,17.45 17.65,17.8 18.38,18.54 v18.41,18.54 | U4.9 U4.8 U4.7 U4.6 U4.5 | U4.5 U4.4 | U4.5 17.08,13.97 | U4.9 17.08,17.45
  Bottom 0.762: J2.2 8,14.43 8,18.8 8.64,19.43 17.78,19.43 18.41,18.8 v18.41,18.54
PHASE_C1  (via drill 0.8)
  Top 0.203: U2.11 12.41,3.4 U2.10
  Top 0.305: U2.4 12.41,6.86 U2.3
  Top 0.762: U2.5 U2.4 12.15,6.36 v10.68,6.36 v10.67,6.35 | U2.5 U2.6 | U2.6 U2.7 | U2.6 U2.8 | U2.6 U2.9 | U2.9 U2.10 | U2.9 12.41,3.4 | U2.5 12.41,6.86
  Bottom 0.762: v10.67,6.35 6.25,6.35 J2.3
SHA_1  (via drill 0.35)
  Top 0.203: U3.2 25.57,15.83 25.91,15.49 v25.91,15.39 | v25.02,14.1 25.41,13.7 U$2.6
  Bottom 0.203: v25.02,14.1 25.02,14.35 25.91,15.24 v25.91,15.39
SHB_1
  Top 0.203: U$2.11 20.84,10.15 17.75,13.24 U4.2
SHC_1
  Top 0.203: U$2.14 18.28,8.65 17.05,9.88 11.91,9.88 11.18,9.14 11.18,8.25 11.81,7.61 U2.2
SWCLK
  Top 0.203: U1.49 59.75,7.17 SV1.3
SWDIO
  Top 0.203: SV1.2 57.4,2.29 44.2,2.29 43.14,3.35 U1.46